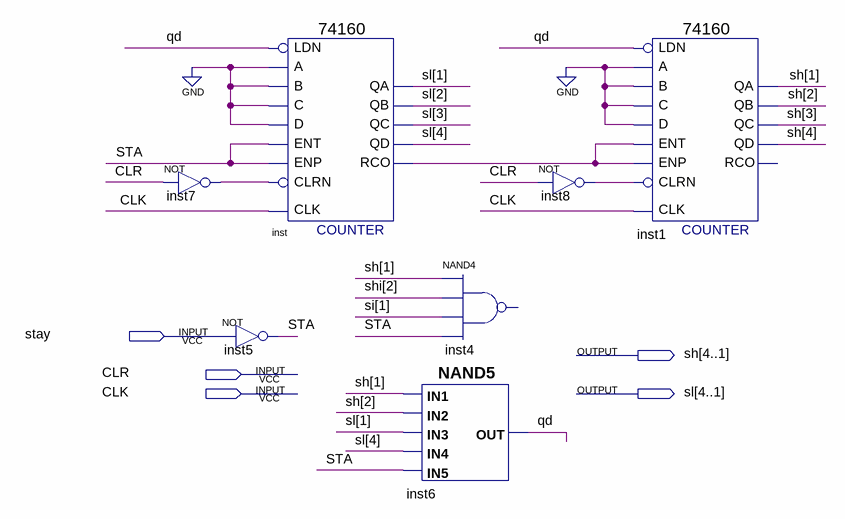
[diagram p0: schematic sheet]
// Quartus schematic mo16.bdf as structural Verilog: 7 symbols, 5 pins
module mo16 (
  input  stay,
  input  CLR,
  input  CLK,
  output [4:1] sh,
  output [4:1] sl
);

  wire inst7_out, inst8_out, inst_rco, qd, STA;
  wire [1:1] si;
  wire [2:2] shi;

  not inst7 (inst7_out, CLR);
  \74160  inst (
    .CLK(CLK), .ENT(STA), .A(1'b0), .B(1'b0), .C(1'b0), .D(1'b0), .LDN(qd), .ENP(STA), .CLRN(inst7_out),
    .QD(sl[4]), .QA(sl[1]), .QB(sl[2]), .QC(sl[3]), .RCO(inst_rco));
  not inst5 (STA, stay);
  nand inst6 (qd, sh[1], sh[2], sl[1], sl[4], STA);
  // NAND4 inst4 has open pins: IN1=sh[1], IN2=shi[2], IN3=si[1], IN4=STA, OUT=open
  not inst8 (inst8_out, CLR);
  \74160  inst1 (
    .CLK(CLK), .ENT(inst_rco), .A(1'b0), .B(1'b0), .C(1'b0), .D(1'b0), .LDN(qd), .ENP(inst_rco),
    .CLRN(inst8_out), .QD(sh[4]), .QA(sh[1]), .QB(sh[2]), .QC(sh[3]));  // open: RCO
endmodule
